# EAGLE design Slave-v13 (EAGLE 7.1.0)
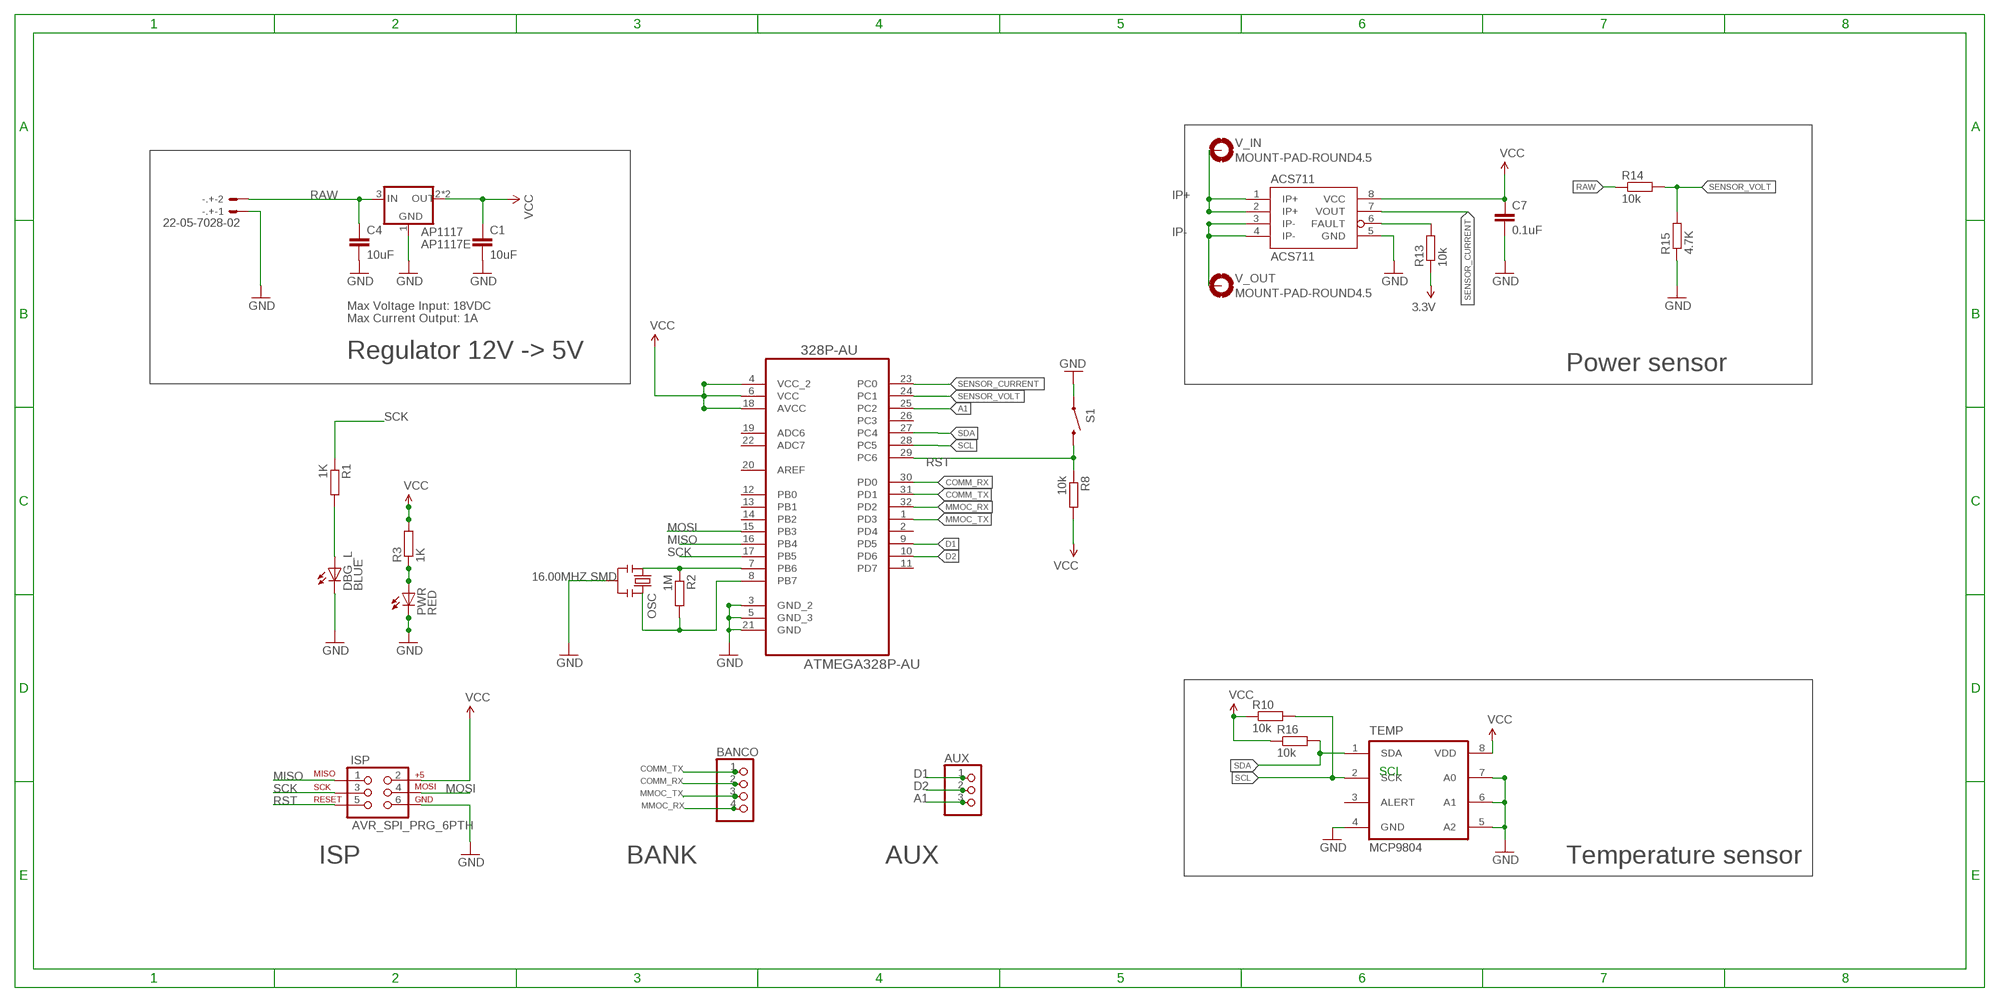
[diagram p0: schematic, sheet 1]

## Parts
328P-AU  ATMEGA328P-AU  [QFP80P900X900X120-32N]
-.+  22-05-7028-02  [7395-02]
ACS711  ACS711  [SOIC8]
AP1117  AP1117E  [SOT223]
AUX  PINHD-1X3  [1X03]
BANCO  PINHD-1X4  [1X04]
C1  10uF  C-EUC0805K  [C0805K]
C4  10uF  C-EUC0805K  [C0805K]
C7  0.1uF  C-EUC0805K  [C0805K]
DBG_L  BLUE  LEDCHIPLED_0805  [CHIPLED_0805]
ISP  AVR_SPI_PRG_6PTH  [2X3]
OSC  16.00MHZ SMD  RESONATOR-SMD  [RESONATOR-SMD]
PWR  RED  LEDCHIPLED_0805  [CHIPLED_0805]
R1  1K  R-EU_R0805  [R0805]
R2  1M  R-EU_R0805  [R0805]
R3  1K  R-EU_R0805  [R0805]
R8  10k  R-EU_R0805  [R0805]
R10  10k  R-EU_R0805  [R0805]
R13  10k  R-EU_R0805  [R0805]
R14  10k  R-EU_R0805  [R0805]
R15  4.7K  R-EU_R0805  [R0805]
R16  10k  R-EU_R0805  [R0805]
S1  SWITCH-MOMENTARY-2-SMD-1101NE  [TACTILE-SWITCH-1101NE]
TEMP  MCP9804  [MSOP8]
V_IN  MOUNT-PAD-ROUND4.5  [4,5-PAD]
V_OUT  MOUNT-PAD-ROUND4.5  [4,5-PAD]

## Nets
A1: 328P-AU.25(PC2) AUX.3
COMM_RX: 328P-AU.30(PD0) BANCO.2
COMM_TX: 328P-AU.31(PD1) BANCO.1
D1: 328P-AU.9(PD5) AUX.1
D2: 328P-AU.10(PD6) AUX.2
GND [power]: 328P-AU.3(GND_2) 328P-AU.5(GND_3) 328P-AU.21(GND) -.+.1 ACS711.5(GND) AP1117.1(GND) C1.2 C4.2 C7.2 DBG_L.C ISP.6 OSC.2 PWR.C R15.1 S1.P$1 TEMP.4(GND) TEMP.5(A2) TEMP.6(A1) TEMP.7(A0)
IP+: ACS711.1(IP+) ACS711.2(IP+) V_IN.B4,5(MOUNT)
IP-: ACS711.3(IP-) ACS711.4(IP-) V_OUT.B4,5(MOUNT)
MISO: 328P-AU.16(PB4) ISP.1
MMOC_RX: 328P-AU.32(PD2)
MMOC_TX: 328P-AU.1(PD3) BANCO.3
MOSI: 328P-AU.15(PB3) ISP.4
N$2: 328P-AU.7(PB6) OSC.1 R2.1
N$3: DBG_L.A R1.2
N$5: PWR.A R3.1
N$14: 328P-AU.8(PB7) OSC.3 R2.2
N$69: ACS711.6(FAULT) R13.2
RAW [power]: -.+.2 AP1117.3(IN) C4.1 R14.1
RST: 328P-AU.29(PC6) ISP.5 R8.1 S1.P$2
SCK: 328P-AU.17(PB5) ISP.3 R1.1
SCL: 328P-AU.28(PC5) R10.2 TEMP.2(SCK)
SDA: 328P-AU.27(PC4) R16.2 TEMP.1(SDA)
SENSOR_CURRENT: 328P-AU.23(PC0) ACS711.7(VOUT)
SENSOR_VOLT: 328P-AU.24(PC1) R14.2 R15.2
VCC [power]: 328P-AU.4(VCC_2) 328P-AU.6(VCC) 328P-AU.18(AVCC) ACS711.8(VCC) AP1117.2(OUT) AP1117.4(OUT) C1.1 C7.1 ISP.2 R3.2 R8.2 R10.1 R13.1 R16.1 TEMP.8(VDD) ; supply symbol labelled 3.3V
Unconnected: 328P-AU.2(PD4) 328P-AU.11(PD7) 328P-AU.12(PB0) 328P-AU.13(PB1) 328P-AU.14(PB2) 328P-AU.19(ADC6) 328P-AU.20(AREF) 328P-AU.22(ADC7) 328P-AU.26(PC3) BANCO.4 TEMP.3(ALERT)

## Notes on the sheet
- Max Voltage Input: 18VDC
- Max Current Output: 1A
- Regulator 12V -> 5V
- Power sensor
- SCL
- ISP | BANK | AUX | Temperature sensor

## Library data of the parts
328P-AU = Atmel_By_element14_Batch_1-00:ATMEGA328P-AU: 8-bit Microcontroller with In-System Programmable Flash; MPN: ATMEGA328P-AU; OC_FARNELL: 1715486; OC_NEWARK: 14R4631; PACKAGE: TQFP-32; SUPPLIER: Atmel
-.+ = con-molex:22-?-02: CONNECTOR wire to board 2.54 mm (.1 inch) pitch header; OC_FARNELL: 9731601; OC_NEWARK: unknown
ACS711 = ACS711:ACS711: Hall-effect-based isolated linear current sensor; MPN: ACS711KLCTR-25AB-T; OC_NEWARK: 24T5972
AP1117 = v-reg:AP1117: LDO Regulator; MPN: AP1117E50G-13; OC_NEWARK: 79R5845
AUX = pinhead:PINHD-1X3: PIN HEADER
BANCO = pinhead:PINHD-1X4: PIN HEADER; OC_NEWARK: unknown
C1 C4 = rcl:C-EU: CAPACITOR, European symbol; MPN: 0805ZD106KAT2A; OC_NEWARK: 96M1311
C7 = rcl:C-EU: CAPACITOR, European symbol; MPN: MC0603B104K500CT; OC_NEWARK: 06R4927
DBG_L = adafruit:LED: LED OSRAM: - CHIPLED LG R971, LG N971, LY N971, LG Q971, LY Q971, LO R971, LY R971 LH N974, LH R974 LS Q976, LO Q976, LY Q976 LO Q996 - Hyper CHIPLED LW Q18S LB Q993, LB Q99A, LB R99A - SideLED LS A670, LO A670, LY A670, LG A670, LP A670 LB A673, LV A673, LT A673, LW A673 LH A674 LY A675 LS A676, LA A676, LO A676, LY A676, LW A676 LS A679, LY A679, LG A679 - Hyper Micro SIDELED® LS Y876, LA Y876, LO Y876, LY Y876 LT Y87S - SmartLED LW L88C, LW L88S LB L89C, LB L89S, LG L890 LS L89K, LO L89K, LY L89K LS L896, LA L896, LO L896, LY L896 - TOPLED LS T670, LO T670, LY T670, LG T670, LP T670 LSG T670, LSP T670, LSY T670, LOP T670, LYG T670 LG T671, LOG T671, LSG T671 LB T673, LV T673, LT T673, LW T673 LH T674 LS T676, LA T676, LO T676, LY T676, LB T676, LH T676, LSB T676, LW T676 LB T67C, LV T67C, LT T67C, LS T67K, LO T67K, LY T67K, LW E67C LS E67B, LA E67B, LO E67B, LY E67B, LB E67C, LV E67C, LT E67C LW T67C LS T679, LY T679, LG T679 LS T770, LO T770, LY T770, LG T770, LP T770 LB T773, LV T773, LT T773, LW T773 LH T774 LS E675, LA E675, LY E675, LS T675 LS T776, LA T776, LO T776, LY T776, LB T776 LHGB T686 LT T68C, LB T68C - Hyper Mini TOPLED® LB M676 - Mini TOPLED Santana® LG M470 LS M47K, LO M47K, LY M47K Source: http://www.osram.convergy.de/; MPN: 150080BS75000; OC_NEWARK: 95W3799
ISP = SparkFun-Connectors:AVR_SPI_PRG_6: AVR ISP 6 Pin This is the reduced ISP connector for AVR programming. Common on Arduino. This footprint will take up less PCB space and can be used with a 10-pin to 6-pin adapter such as SKU: BOB-08508; OC_NEWARK: unknown
OSC = resonador:RESONATOR-: Resonator Small SMD resonator. This is the itty bitty 10/20MHz resonators with built in caps. CSTCE10M0G55 and CSTCE20M0V53. Footprint has been reviewed closely but hasn't been tested yet.; MPN: PBRC8.00HR50X000; OC_NEWARK: 23M7097
PWR = adafruit:LED: LED OSRAM: - CHIPLED LG R971, LG N971, LY N971, LG Q971, LY Q971, LO R971, LY R971 LH N974, LH R974 LS Q976, LO Q976, LY Q976 LO Q996 - Hyper CHIPLED LW Q18S LB Q993, LB Q99A, LB R99A - SideLED LS A670, LO A670, LY A670, LG A670, LP A670 LB A673, LV A673, LT A673, LW A673 LH A674 LY A675 LS A676, LA A676, LO A676, LY A676, LW A676 LS A679, LY A679, LG A679 - Hyper Micro SIDELED® LS Y876, LA Y876, LO Y876, LY Y876 LT Y87S - SmartLED LW L88C, LW L88S LB L89C, LB L89S, LG L890 LS L89K, LO L89K, LY L89K LS L896, LA L896, LO L896, LY L896 - TOPLED LS T670, LO T670, LY T670, LG T670, LP T670 LSG T670, LSP T670, LSY T670, LOP T670, LYG T670 LG T671, LOG T671, LSG T671 LB T673, LV T673, LT T673, LW T673 LH T674 LS T676, LA T676, LO T676, LY T676, LB T676, LH T676, LSB T676, LW T676 LB T67C, LV T67C, LT T67C, LS T67K, LO T67K, LY T67K, LW E67C LS E67B, LA E67B, LO E67B, LY E67B, LB E67C, LV E67C, LT E67C LW T67C LS T679, LY T679, LG T679 LS T770, LO T770, LY T770, LG T770, LP T770 LB T773, LV T773, LT T773, LW T773 LH T774 LS E675, LA E675, LY E675, LS T675 LS T776, LA T776, LO T776, LY T776, LB T776 LHGB T686 LT T68C, LB T68C - Hyper Mini TOPLED® LB M676 - Mini TOPLED Santana® LG M470 LS M47K, LO M47K, LY M47K Source: http://www.osram.convergy.de/; MPN: KPT-2012SRC-J4; OC_NEWARK: 88W4951
R1 R3 = rcl:R-EU_: RESISTOR, European symbol; MF: VISHAY/DALE; MPN: CRCW08051K00FKTA; OC_NEWARK: 05F1507
R2 R8 R10 R13 R14 R16 = rcl:R-EU_: RESISTOR, European symbol; MF: VISHAY/DALE; MPN: CRCW080510K0FKTA; OC_NEWARK: 05F1511
R15 = rcl:R-EU_: RESISTOR, European symbol; MF: VISHAY/DALE; MPN: CRCW08053K30FKTA; OC_NEWARK: 48F4423
S1 = SparkFun-Electromechanical:SWITCH-MOMENTARY-2: Various NO switches- pushbuttons, reed, etc; OC_NEWARK: unknown
TEMP = MCP9804:MCP9804: TEMP SENSOR; MPN: MCP9808-E/MS; OC_NEWARK: 89T8871
V_IN V_OUT = holes:MOUNT-PAD-ROUND: MOUNTING PAD, round; OC_NEWARK: unknown

## Net classes
0 default: width 0.203 mm
1 power: width 0.254 mm

## Board
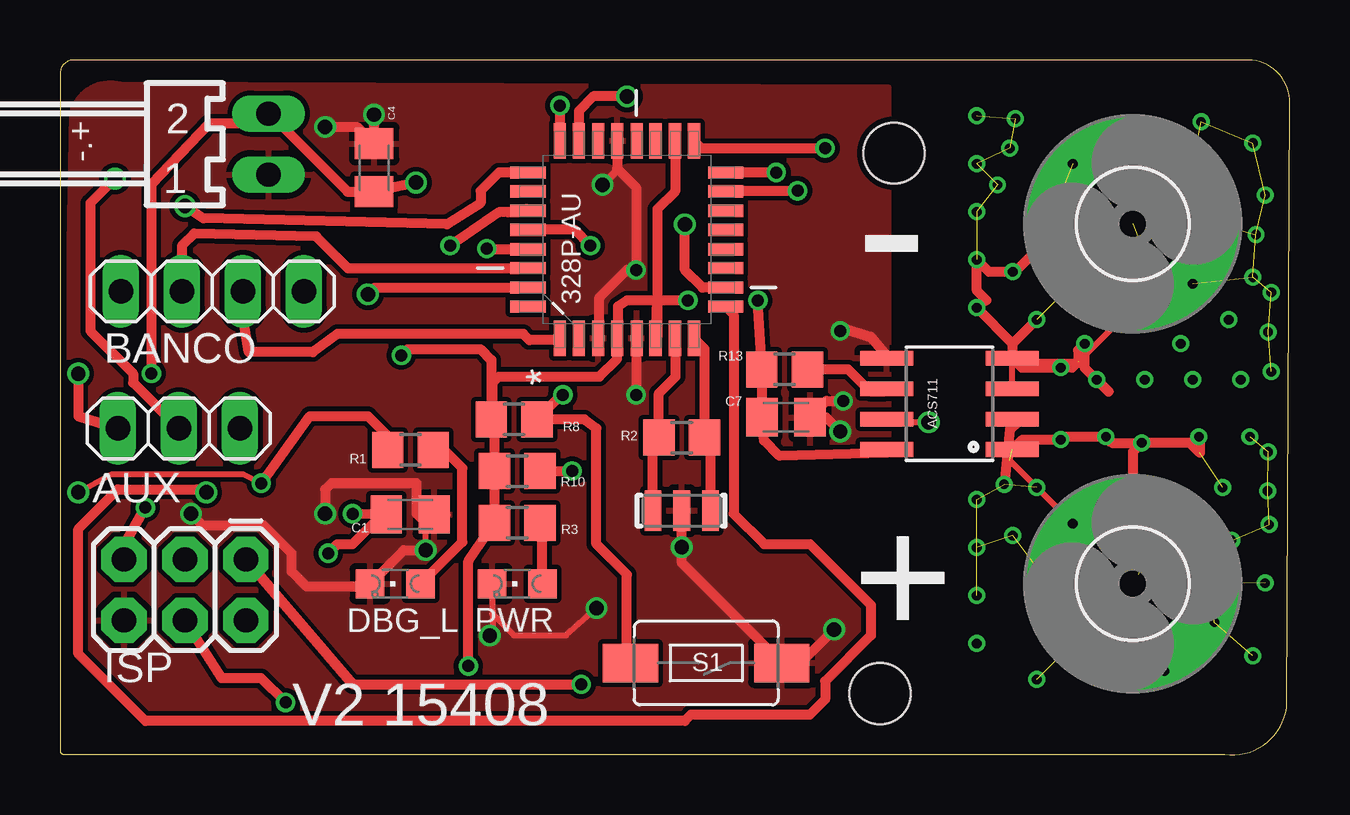
[diagram p1: board, top side]
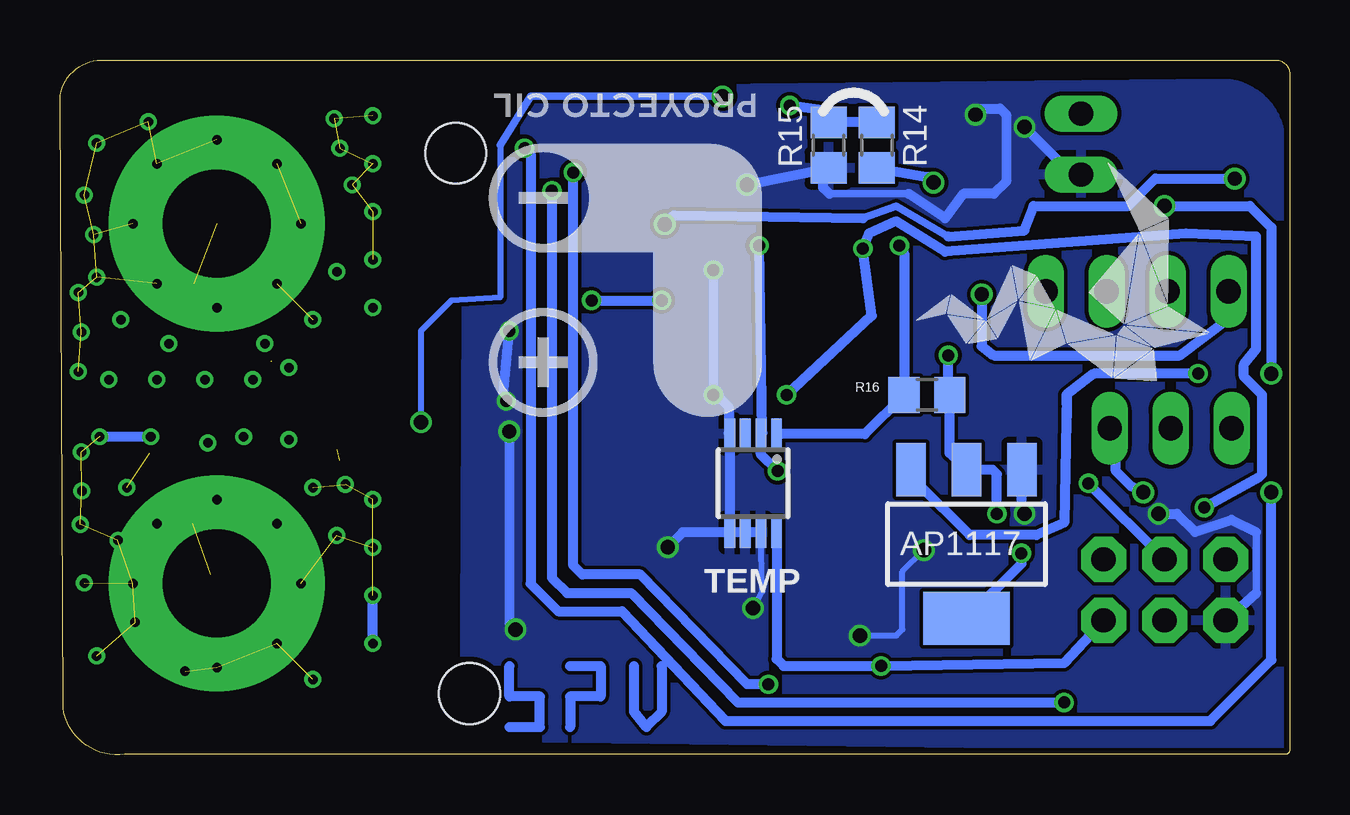
[diagram p2: board, bottom side, seen from below]

Size 51.23 x 28.97 mm. Coordinates in mm from the lower left corner, seen from the top.
Outline: 0,28.45 0,0.19 arc90 0.17,0.02 48.52,0.02 arc90 51.11,1.97 51.23,27.34 arc90 49.35,28.97 0.65,28.97 arc90 0,28.45
Copper layers (1*16): Top 0.035mm / dielectric 1.5mm / Bottom 0.035mm
Design rules "ITEADstudio_DRC": minimum track width 6mil, minimum drill 12mil, track to track 6mil, track to pad 6mil, pad to pad 6mil, via to via 6mil, smd to smd 0mil, copper to edge 10mil, drill to drill 10mil, minimum pad ring 10mil, minimum via ring 6mil, stop-mask expansion 2mil, vias tented up to drill 100mil, thermal gap 10mil
Holes 2.54 mm at 34.16,2.56 34.74,25.08

### Footprints (pad centres in the part's own frame; a part is rotated, then mirrored left to right if it is on the bottom)
QFP80P900X900X120-32N = smd 1.473 x 0.508: 1 -4.115,2.794; 2 -4.115,2.007; 3 -4.115,1.194; 4 -4.115,0.406; 5 -4.115,-0.406; 6 -4.115,-1.194; 7 -4.115,-2.007; 8 -4.115,-2.794; 17 4.115,-2.794; 18 4.115,-2.007; 19 4.115,-1.194; 20 4.115,-0.406; 21 4.115,0.406; 22 4.115,1.194; 23 4.115,2.007; 24 4.115,2.794 | smd 0.508 x 1.473: 9 -2.794,-4.115; 10 -2.007,-4.115; 11 -1.194,-4.115; 12 -0.406,-4.115; 13 0.406,-4.115; 14 1.194,-4.115; 15 2.007,-4.115; 16 2.794,-4.115; 25 2.794,4.115; 26 2.007,4.115; 27 1.194,4.115; 28 0.406,4.115; 29 -0.406,4.115; 30 -1.194,4.115; 31 -2.007,4.115; 32 -2.794,4.115
7395-02 = drill 1.016 long: 1 1.27,0; 2 -1.27,0
SOIC8 = smd 0.61 x 2.21: 1 -1.905,-2.616; 2 -0.635,-2.616; 3 0.635,-2.616; 4 1.905,-2.616; 5 1.905,2.616; 6 0.635,2.616; 7 -0.635,2.616; 8 -1.905,2.616
SOT223 = smd 1.219 x 2.235: 1 -2.311,-3.099; 2 0,-3.099; 3 2.311,-3.099 | smd 3.6 x 2.2: 4 0,3.099
1X03 = drill 1.016 long: 1 -2.54,0; 2 0,0; 3 2.54,0
1X04 = drill 1.016 long: 1 -3.81,0; 2 -1.27,0; 3 1.27,0; 4 3.81,0
C0805K = smd 1.3 x 1.6: 1 -1,0; 2 1,0
CHIPLED_0805 = smd 1.2 x 1.2: A 0,-1.05; C 0,1.05
2X3 = drill 1.016 pad 1.88 octagon: 1 0,0; 2 0,2.54; 3 2.54,0; 4 2.54,2.54; 5 5.08,0; 6 5.08,2.54
RESONATOR-SMD = smd 0.7 x 1.7: 1 -1.2,0; 2 0,0; 3 1.2,0
R0805 = smd 1.3 x 1.5: 1 -0.95,0; 2 0.95,0
TACTILE-SWITCH-1101NE = smd 2.3 x 1.6: P$1 -3.15,0; P$2 3.15,0
MSOP8 = smd 0.45 x 1.3: 1 -0.975,-2.05; 2 -0.325,-2.05; 3 0.325,-2.05; 4 0.975,-2.05; 5 0.975,2.05; 6 0.325,2.05; 7 -0.325,2.05; 8 -0.975,2.05
4,5-PAD = drill 4.5 pad 9: B4,5 0,0

### Placement (x,y rotation side)
328P-AU  23.62,21.48 90 top
-.+  8.69,25.46 270 top
ACS711  37.07,14.63 90 top
AP1117  13.46,8.78 180 bottom
AUX  4.95,13.61 180 top
BANCO  6.35,19.32 0 top
C1  14.6,10.02 0 top
C4  13.09,24.48 90 top
C7  30.25,14.07 0 top
DBG_L  13.97,7.13 90 top
ISP  7.75,8.15 180 top
OSC  25.91,10.18 0 top
PWR  19.05,7.13 90 top
R1  14.6,12.72 0 top
R2  25.91,13.23 0 top
R3  19.05,9.67 180 top
R8  18.92,13.99 180 top
R10  19.05,11.83 0 top
R13  30.19,16.07 0 top
R14  17.19,25.42 90 bottom
R15  19.21,25.42 90 bottom
R16  15.11,15.01 180 bottom
S1  26.92,3.83 180 top
TEMP  22.35,11.32 180 bottom
U$1  [LOGO_CIL]  20.07,28.47 180 bottom
U$4  [LOGO_ELIBATT2]  3.18,25.04 180 bottom
V_IN  44.7,7.14 0 top
V_OUT  44.7,22.14 0 top

### Tracks (layer width: path | path; a pad name or v marks a point on that pad's centre or on a via)
A1  (via drill 0.6)
  Top 0.406: 328P-AU.25 18.29,24.28 17.53,23.51 17.53,23.01 16.13,22.12 5.97,22.37 v5.21,22.88 | v0.76,15.89 0.76,14.12 AUX.3
  Bottom 0.406: v5.21,22.88 1.65,22.88 0.76,21.99 v0.76,15.89
COMM_RX
  Top 0.406: 328P-AU.30 12,20.29 10.68,21.61 5.59,21.74 5.08,21.23 BANCO.2
COMM_TX  (via drill 0.6)
  Top 0.406: 328P-AU.31 13.11,19.48 v12.83,19.2
  Bottom 0.406: v12.83,19.2 12.83,17.04 12.32,16.66 4.57,16.66 2.54,18.18 BANCO.1
D1  (via drill 0.6)
  Top 0.406: 328P-AU.9 28.07,18.36 28.07,10.05 29.34,8.78 31.24,8.78 33.78,6.24 33.78,4.97 31.88,3.07 31.88,2.31 31.24,1.67 26.29,1.67 26.04,1.42 3.56,1.42 0.76,4.21 0.76,9.42 2.41,11.07 5.71,11.07 v6.1,10.94 5.84,11.07
  Bottom 0.406: v6.1,10.94 6.6,11.2 7.24,11.83 7.24,13.35 AUX.1
D2  (via drill 0.6)
  Top 0.406: 328P-AU.10 26.77,19.48 26.04,20.21 v26.04,22.12 | v2.29,24.02 1.27,23.01 1.27,17.67 3.05,15.89 3.05,15.51 AUX.2
  Bottom 0.305: 17.78,22.37 16.38,22.88 14.22,21.61
  Bottom 0.406: v26.04,22.12 25.65,22.5 17.78,22.37 | v2.29,24.02 5.59,24.02 6.73,22.88 10.67,22.88 11.05,21.86 14.22,21.61
GND  (via drill 0.5 pad 0.25, 0.6)
  Top 0.254: 16.16,10.02 C1.2 15.24,9.67 v15.24,8.53 | v22.35,6.12 21.08,4.97 18.92,4.97 18,5.9 PWR.C 18,6.02 18.03,5.99 18.03,5.23 v17.91,4.97
  Top 0.305: 328P-AU.21 23.22,24.38 v22.61,23.77
  Top 0.406: v32.64,14.75 31.93,14.75 C7.2 31.92,14.07 v32.51,13.48 | v32.51,17.67 32.64,17.8 33.78,17.42 34.45,16.62 ACS711.5 | 328P-AU.3 22.48,17.42 22.48,19.07 23.62,20.21 v24,20.21 24,23.64 23.22,24.43 328P-AU.21 | v24,15.01 24.03,15.03 328P-AU.5 | v11.05,26.18 12.38,26.18 C4.2 v13.09,26.69 v13.08,26.69 | OSC.2 v25.91,8.66 25.91,8 S1.P$1 30.86,3.83 v32.26,5.23 | v15.24,8.53 14.32,8.53 DBG_L.C 12.79,7 10.29,7 9.65,7.64 9.65,8.4 8.51,9.54 5.97,9.54 v5.46,10.05 | 15.24,9.67 14.86,10.05 14.86,11.32 11.3,11.32 11.05,11.07 v11.05,10.05
  Bottom 0.254: v22.35,6.12 21.97,6.8 TEMP.7 | v17.91,4.97 16.38,4.97 16.13,5.23 16.13,7.64 v15.24,8.53
  Bottom 0.305: 19.14,24.53 R15.1 | 1.4,9.29 1.4,6.75 | 15.87,23.39 19.18,23.39
  Bottom 0.406: v32.64,14.75 32.77,15.01 v32.51,17.67 | v24,20.21 v24,15.01 23.88,15.01 23.37,14.5 23.37,13.41 TEMP.4 TEMP.5 | -.+.1 9.06,24.19 v11.05,26.18 | TEMP.7 TEMP.6 TEMP.5 | TEMP.5 25.29,9.27 v25.91,8.66 | v32.51,13.48 32.51,5.48 v32.26,5.23 | v11.05,10.05 11.15,10.15 AP1117.1 | v22.61,23.77 R15.1 19.21,24.12 19.43,23.9 19.43,23.64 19.18,23.39 | 1.4,9.29 2.41,9.8 3.94,9.29 4.7,10.05 v5.46,10.05 | 1.4,6.75 ISP.6 | v13.08,26.69 13.08,26.94 12.06,26.94 11.81,26.69 11.81,23.9 12.32,23.39 13.59,23.39 14.35,22.37 15.87,23.39
  pour Bottom: 34.8,0.78 0.5,0.34 arc-89 0.01,1.5 0.38,25.48 arc-90 2.73,27.97 34.27,27.65 34.39,0.85
  pour Top (isolate 0.2): 0,0.53 0.51,26.75 arc-90 2.48,27.96 34.52,27.83 34.52,0.78
IP+  (via drill 0.4)  (20 unrouted)
  Top 0.254: 39.58,13.56 39.58,12.26 v42.2,9.64
  Top 0.406: ACS711.2 39.82,13.86 39.88,13.86 39.58,13.56 v39.34,11.28 | ACS711.1 40.1,13.14 v41.7,13.14 41.82,13.26 v43.58,13.26 43.83,13.01 v45.07,13.01 | v47.45,13.26 47.5,13.22 47.5,12.59 47.08,13.01 v45.07,13.01 | v45.07,13.01 44.7,12.63 v44.7,10.64 45.7,9.64 v47.2,9.64 | V_IN.B4,5 44.96,7.4 44.96,7.51 42.2,4.75 v42.2,4.64
  Bottom 0.406: v49.58,13.26 v47.45,13.26 | v38.2,4.64 v38.2,6.64
  other vias: 50.34,12.63 48.82,8.94 48.1,5.53 46.02,3.48 50.21,7.17 49.71,4.12 48.44,11.14 50.32,11 50.38,9.6 40.7,11.14 38.2,10.64 38.2,8.64 39.7,9.14 40.7,3.14 41.2,7.14 48.2,7.14 44.7,3.64
IP-  (via drill 0.4)  (21 unrouted)
  Top 0.254: ACS711.3 39.68,16.21 39.88,16.4 42.46,16.4 v44.7,18.64
  Top 0.406: ACS711.4 40.08,16.14 v41.7,16.14 42.16,16.14 42.42,16.4 42.42,16.86 v42.7,17.14 42.7,16.12 43.69,15.13 43.69,15.15 v43.2,15.64 | v44.7,18.64 44.96,18.9 44.96,18.94 45.66,19.64 v47.2,19.64 | v40.7,18.14 39.68,17.13 ACS711.4 | ACS711.4 39.68,17.16 v38.2,18.64 38.5,18.94 38.61,18.94 38.2,19.35 v38.2,20.64 38.7,20.14 v39.7,20.14 39.81,20.14 41.15,21.48 41.15,22.09 v41.2,22.14
  other vias: 38.2,26.64 39.81,26.52 38.2,24.64 39.06,23.76 39.57,25.29 38.2,22.64 42.2,19.64 42.2,24.64 44.7,25.64 47.2,24.64 48.2,22.14 47.55,26.39 49.71,25.5 50.21,23.34 49.71,19.91 50.34,17.63 50.47,15.97 50.47,19.28 49.83,21.69
MISO  (via drill 0.5 pad 0.25)
  Top 0.406: ISP.1 12.19,2.94 v21.72,2.94 | v29.85,24.28 328P-AU.16
  Bottom 0.406: v21.72,2.94 22.61,2.94 27.05,7.51 29.46,7.51 29.85,7.89 v29.85,24.28
MMOC_TX
  Top 0.406: 328P-AU.1 20.75,17.29 19.56,17.29 19.3,17.55 11.56,17.55 10.54,16.78 7.87,16.78 7.62,18.31 BANCO.3
MOSI  (via drill 0.5 pad 0.25)
  Top 0.406: 328P-AU.15 27.76,23.51 v30.73,23.51 | v9.4,2.18 8.38,3.19 6.73,3.19 ISP.4
  Bottom 0.406: v30.73,23.51 30.73,7.39 30.1,6.75 27.43,6.75 22.99,2.18 v9.4,2.18
N$1
  Bottom 0.406: 32.51,1.16 31.24,1.16 31.24,2.43 32.51,2.43 32.51,3.7
N$2
  Top 0.406: OSC.1 24.71,12.98 R2.1 24.96,15.07 25.65,15.77 25.65,17.34 328P-AU.7
N$3
  Top 0.406: DBG_L.A 16.76,8.88 16.76,11.96 16,12.72 R1.2
N$4
  Bottom 0.406: 29.97,3.7 28.7,3.7 28.7,2.43 29.97,2.43 29.97,1.16
N$5
  Top 0.406: PWR.A 20.1,9.57 R3.1
N$6
  Bottom 0.406: 26.16,3.7 26.16,1.8 26.8,1.16 27.3,1.8 27.3,3.7
N$14
  Top 0.406: OSC.3 27.11,12.98 R2.2 26.86,16.93 328P-AU.8
N$37  (via drill 0.4)
  other vias: 49.2,15.64
N$58  (via drill 0.4)
  other vias: 47.2,15.64
N$59  (via drill 0.4)
  other vias: 45.2,15.64
N$61  (via drill 0.4)
  other vias: 46.7,17.14
N$69
  Top 0.406: ACS711.6 34.32,15.13 33.78,15.13 32.84,16.07 R13.2
N$70  (via drill 0.4)
  other vias: 48.7,18.14
RAW  (via drill 0.5 pad 0.25, 0.6)
  Top 0.406: v14.83,23.86 C4.1 11.99,23.48 9.28,26.19 | 3.81,16.02 v3.81,15.89 3.81,23.77 6.22,26.31 9.16,26.31 9.28,26.19 | -.+.2 9.23,26.19 9.28,26.19
  Bottom 0.406: 9.27,14.1 9.29,15.01 | 9.29,15.01 9.4,9.67 10.54,9.16 13.33,9.16 15.49,11.32 15.62,11.32 15.77,11.47 AP1117.3 | v3.81,15.89 8.16,15.89 9.29,15.01 | R14.1 15.06,24.09 v14.83,23.86
RST  (via drill 0.5 pad 0.25)
  Top 0.406: S1.P$2 23.62,3.98 23.62,7.51 22.35,8.78 22.35,13.61 21.84,13.99 R8.1 20.89,15.01 v20.96,15.01 | v17.78,21.1 17.76,21.08 328P-AU.29 | ISP.5 2.41,8.27 v3.56,10.31
  Bottom 0.406: v20.96,15.01 17.4,18.31 v17.78,21.1 17.53,21.74 16.38,22.24 14.35,20.97 4.32,21.74 1.4,21.61 1.4,16.91 1.9,16.28 1.9,15.77 1.14,15.01 1.14,11.7 1.27,11.58 v3.56,10.31
SCK  (via drill 0.5 pad 0.25, 0.6)
  Top 0.254: v0.76,10.94 2.16,11.7 7.62,11.7 v8.38,11.32
  Top 0.406: v8.38,11.32 10.41,14.12 12.83,14.12 13.65,13.29 R1.1 | 328P-AU.17 26.72,25.29 v31.88,25.29
  Bottom 0.406: ISP.3 v8.38,11.32 | v31.88,25.29 31.62,25.04 31.62,7.13 30.48,5.99 27.81,5.99 23.5,1.42 3.3,1.42 0.76,3.96 v0.76,10.94
SCL  (via drill 0.5 pad 0.25)
  Top 0.406: R10.2 v21.34,11.83 | v22.1,21.23 21.44,21.89 328P-AU.28
  Bottom 0.406: v21.34,11.83 22.03,12.52 TEMP.2 21.97,13.43 v22.1,21.23
SDA  (via drill 0.5 pad 0.25)
  Top 0.406: 328P-AU.27 19.43,22.75 18.67,22.63 18.29,22.63 v16.26,21.23
  Bottom 0.406: v16.26,21.23 16.06,20.91 R16.2 17.7,13.37 TEMP.1
SENSOR_CURRENT  (via drill 0.6, 0.6 pad 0.3)
  Top 0.254: v36.2,13.86 34.59,13.86 ACS711.7
  Top 0.406: v23.62,27.45 22.23,27.45 21.62,26.84 328P-AU.23
  Bottom 0.254: 32.89,25.42 32.89,19.07 34.93,18.94 36.2,17.67 v36.2,13.86
  Bottom 0.305: 32.89,25.42 31.62,27.45 v23.62,27.45
SENSOR_VOLT  (via drill 0.5 pad 0.25)
  Top 0.406: v20.83,27.07 328P-AU.24
  Bottom 0.406: v20.83,27.07 19.33,26.85 R15.2 R14.2
VCC  (via drill 0.5 pad 0.25)
  Top 0.305: ACS711.8
  Top 0.406: ACS711.8 34.45,12.59 29.97,12.47 29.34,13.1 29.21,14.03 C7.1 R13.1 29.24,16.24 v29.08,18.94 | v17.02,3.7 17.02,8.08 R3.2 R10.1 18.1,13.86 18.03,13.93 | 328P-AU.18 25.63,23.49 24.89,22.75 24.89,18.94 | 24.89,18.94 24.89,17.44 328P-AU.6 24.89,18.94 | v26.16,18.94 24.89,18.94 | 24.89,18.94 23.62,18.94 23.24,18.69 328P-AU.4 23.22,16.5 22.48,15.77 | 18.03,13.93 R8.2 17.97,16.46 17.53,16.91 14.48,16.91 v14.22,16.66 | 18.03,13.93 18.03,15.51 18.29,15.77 | 18.29,15.77 22.48,15.77 | v11.18,8.4 11.56,8.78 12.19,8.78 13.43,10.02 C1.1 12.29,10.05 v12.19,10.05 | 18.29,15.77 22.48,15.77
  Bottom 0.406: ISP.2 9.4,3.83 v17.02,3.7 21.08,3.7 21.38,4 TEMP.8 | v29.08,18.94 v26.16,18.94 | v14.22,16.66 14.22,15.07 R16.1 14.16,12.58 AP1117.2 12.37,11.88 12.19,11.7 v12.19,10.05 | AP1117.4 11.18,7.97 v11.18,8.4

### Text on the board
tNames: - | + | V2 15408